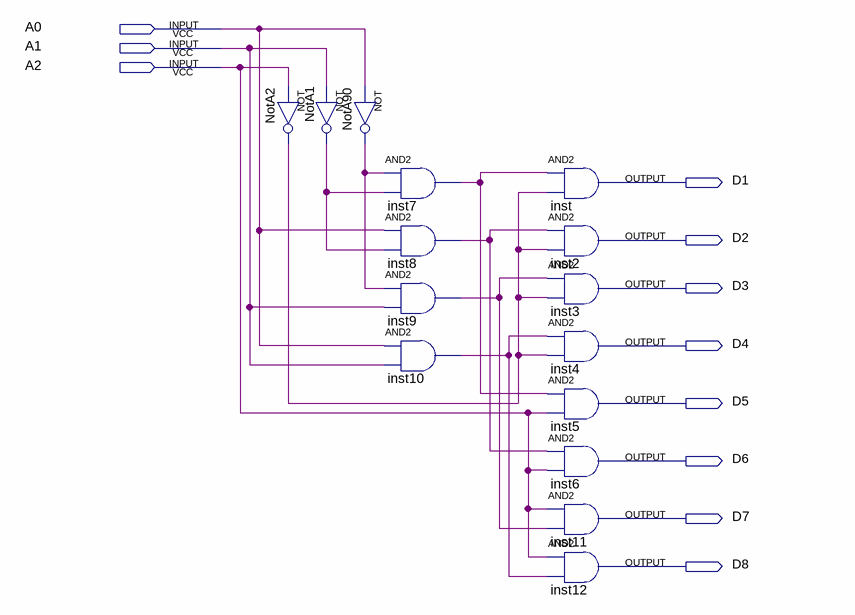
[diagram p0: schematic sheet]
// Quartus schematic Decoder3to8.bdf as structural Verilog: 15 symbols, 11 pins
module Decoder3to8 (
  input  A0,
  input  A1,
  input  A2,
  output D1,
  output D2,
  output D3,
  output D4,
  output D5,
  output D6,
  output D7,
  output D8
);

  wire inst7_out, inst8_out, inst9_out, inst10_out, NotA1_out, NotA2_out, NotA90_out;

  not NotA2 (NotA2_out, A2);
  not NotA1 (NotA1_out, A1);
  not NotA90 (NotA90_out, A0);
  and inst7 (inst7_out, NotA90_out, NotA1_out);
  and inst8 (inst8_out, A0, NotA1_out);
  and inst9 (inst9_out, NotA90_out, A1);
  and inst10 (inst10_out, A0, A1);
  and inst (D1, inst7_out, NotA2_out);
  and inst2 (D2, inst8_out, NotA2_out);
  and inst3 (D3, inst9_out, NotA2_out);
  and inst4 (D4, inst10_out, NotA2_out);
  and inst5 (D5, inst7_out, A2);
  and inst6 (D6, inst8_out, A2);
  and inst11 (D7, A2, inst9_out);
  and inst12 (D8, A2, inst10_out);
endmodule
